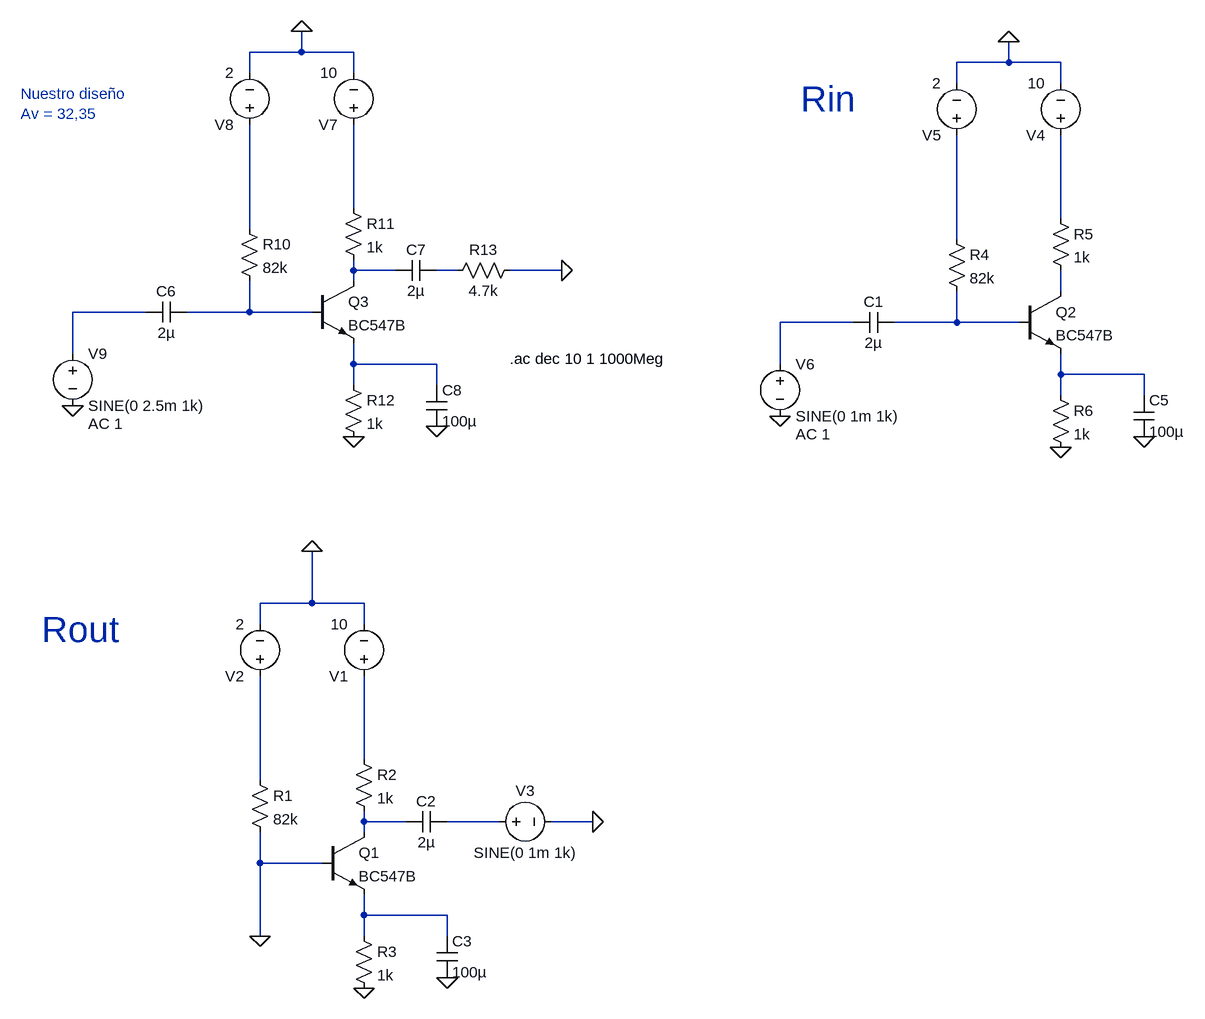
[diagram p0: schematic amplificador_super_magico.asc]
amplificador_super_magico.asc, the LTspice schematic file:
Version 4
SHEET 1 1524 1892
WIRE 16 432 16 400
WIRE 16 432 -64 432
WIRE 96 432 16 432
WIRE 1104 448 1104 416
WIRE 1104 448 1024 448
WIRE 1184 448 1104 448
WIRE -64 464 -64 432
WIRE 96 464 96 432
WIRE 1024 480 1024 448
WIRE 1184 480 1184 448
WIRE 96 672 96 544
WIRE 1184 688 1184 560
WIRE -64 704 -64 544
WIRE 1024 720 1024 560
WIRE 96 768 96 752
WIRE 160 768 96 768
WIRE 256 768 224 768
WIRE 416 768 336 768
WIRE 96 784 96 768
WIRE 1184 800 1184 768
WIRE -224 832 -336 832
WIRE -64 832 -64 784
WIRE -64 832 -160 832
WIRE 32 832 -64 832
WIRE 864 848 752 848
WIRE 1024 848 1024 800
WIRE 1024 848 928 848
WIRE 1120 848 1024 848
WIRE -336 896 -336 832
WIRE 96 912 96 880
WIRE 224 912 96 912
WIRE 752 912 752 848
WIRE 1184 928 1184 896
WIRE 1312 928 1184 928
WIRE 96 944 96 912
WIRE 224 944 224 912
WIRE 1184 960 1184 928
WIRE 1312 960 1312 928
WIRE 32 1280 32 1200
WIRE 32 1280 -48 1280
WIRE 112 1280 32 1280
WIRE -48 1312 -48 1280
WIRE 112 1312 112 1280
WIRE 112 1520 112 1392
WIRE -48 1552 -48 1392
WIRE 112 1616 112 1600
WIRE 176 1616 112 1616
WIRE 320 1616 240 1616
WIRE 464 1616 400 1616
WIRE 112 1632 112 1616
WIRE -48 1680 -48 1632
WIRE 48 1680 -48 1680
WIRE 112 1760 112 1728
WIRE 240 1760 112 1760
WIRE -48 1792 -48 1680
WIRE 112 1792 112 1760
WIRE 240 1792 240 1760
FLAG 96 1024 0
FLAG 16 400 0
FLAG -336 976 0
FLAG 416 768 0
FLAG 224 1008 0
FLAG 112 1872 0
FLAG 240 1856 0
FLAG 32 1200 0
FLAG -48 1792 0
FLAG 464 1616 0
FLAG 1184 1040 0
FLAG 1104 416 0
FLAG 752 992 0
FLAG 1312 1024 0
SYMBOL npn 32 784 R0
SYMATTR InstName Q3
SYMATTR Value BC547B
SYMBOL res -80 688 R0
SYMATTR InstName R10
SYMATTR Value 82k
SYMBOL res 80 656 R0
SYMATTR InstName R11
SYMATTR Value 1k
SYMBOL res 80 928 R0
SYMATTR InstName R12
SYMATTR Value 1k
SYMBOL voltage 96 560 R180
WINDOW 123 0 0 Left 0
WINDOW 39 0 0 Left 0
SYMATTR InstName V7
SYMATTR Value 10
SYMBOL voltage -64 560 R180
WINDOW 123 0 0 Left 0
WINDOW 39 0 0 Left 0
SYMATTR InstName V8
SYMATTR Value 2
SYMBOL voltage -336 880 R0
WINDOW 123 24 124 Left 2
WINDOW 39 0 0 Left 0
SYMATTR Value2 AC 1
SYMATTR InstName V9
SYMATTR Value SINE(0 2.5m 1k)
SYMBOL cap -160 816 R90
WINDOW 0 0 32 VBottom 2
WINDOW 3 32 32 VTop 2
SYMATTR InstName C6
SYMATTR Value 2µ
SYMBOL res 352 752 R90
WINDOW 0 0 56 VBottom 2
WINDOW 3 32 56 VTop 2
SYMATTR InstName R13
SYMATTR Value 4.7k
SYMBOL cap 224 752 R90
WINDOW 0 0 32 VBottom 2
WINDOW 3 32 32 VTop 2
SYMATTR InstName C7
SYMATTR Value 2µ
SYMBOL cap 208 944 R0
SYMATTR InstName C8
SYMATTR Value 100µ
SYMBOL npn 48 1632 R0
SYMATTR InstName Q1
SYMATTR Value BC547B
SYMBOL res -64 1536 R0
SYMATTR InstName R1
SYMATTR Value 82k
SYMBOL res 96 1504 R0
SYMATTR InstName R2
SYMATTR Value 1k
SYMBOL res 96 1776 R0
SYMATTR InstName R3
SYMATTR Value 1k
SYMBOL voltage 112 1408 R180
WINDOW 123 0 0 Left 0
WINDOW 39 0 0 Left 0
SYMATTR InstName V1
SYMATTR Value 10
SYMBOL voltage -48 1408 R180
WINDOW 123 0 0 Left 0
WINDOW 39 0 0 Left 0
SYMATTR InstName V2
SYMATTR Value 2
SYMBOL cap 240 1600 R90
WINDOW 0 0 32 VBottom 2
WINDOW 3 32 32 VTop 2
SYMATTR InstName C2
SYMATTR Value 2µ
SYMBOL cap 224 1792 R0
SYMATTR InstName C3
SYMATTR Value 100µ
SYMBOL voltage 304 1616 R270
WINDOW 0 32 56 VTop 2
WINDOW 3 -32 56 VBottom 2
WINDOW 123 0 0 Left 0
WINDOW 39 0 0 Left 0
SYMATTR InstName V3
SYMATTR Value SINE(0 1m 1k)
SYMBOL npn 1120 800 R0
SYMATTR InstName Q2
SYMATTR Value BC547B
SYMBOL res 1008 704 R0
SYMATTR InstName R4
SYMATTR Value 82k
SYMBOL res 1168 672 R0
SYMATTR InstName R5
SYMATTR Value 1k
SYMBOL res 1168 944 R0
SYMATTR InstName R6
SYMATTR Value 1k
SYMBOL voltage 1184 576 R180
WINDOW 123 0 0 Left 0
WINDOW 39 0 0 Left 0
SYMATTR InstName V4
SYMATTR Value 10
SYMBOL voltage 1024 576 R180
WINDOW 123 0 0 Left 0
WINDOW 39 0 0 Left 0
SYMATTR InstName V5
SYMATTR Value 2
SYMBOL voltage 752 896 R0
WINDOW 123 24 124 Left 2
WINDOW 39 0 0 Left 0
SYMATTR Value2 AC 1
SYMATTR InstName V6
SYMATTR Value SINE(0 1m 1k)
SYMBOL cap 928 832 R90
WINDOW 0 0 32 VBottom 2
WINDOW 3 32 32 VTop 2
SYMATTR InstName C1
SYMATTR Value 2µ
SYMBOL cap 1296 960 R0
SYMATTR InstName C5
SYMATTR Value 100µ
TEXT 336 904 Left 2 !.ac dec 10 1 1000Meg
TEXT -416 496 Left 2 ;Nuestro diseño\nAv = 32,35
TEXT 784 504 Left 5 ;Rin
TEXT -384 1320 Left 5 ;Rout

The netlist it stands for:
* amplificador_super_magico.asc
Q3 N005 N009 N012 0 BC547B
R10 N003 N009 82k
R11 N001 N005 1k
R12 N012 0 1k
V7 N001 0 10
V8 N003 0 2
V9 N008 0 SINE(0 2.5m 1k) AC 1
C6 N009 N008 2µ
R13 0 N006 4.7k
C7 N006 N005 2µ
C8 N012 0 100µ
Q1 N016 0 N018 0 BC547B
R1 N015 0 82k
R2 N014 N016 1k
R3 N018 0 1k
V1 N014 0 10
V2 N015 0 2
C2 N017 N016 2µ
C3 N018 0 100µ
V3 N017 0 SINE(0 1m 1k)
Q2 N007 N011 N013 0 BC547B
R4 N004 N011 82k
R5 N002 N007 1k
R6 N013 0 1k
V4 N002 0 10
V5 N004 0 2
V6 N010 0 SINE(0 1m 1k) AC 1
C1 N011 N010 2µ
C5 N013 0 100µ
.model NPN NPN
.model PNP PNP
.lib standard.bjt
.ac dec 10 1 1000Meg
* Nuestro diseño
* Av = 32,35
* Rin
* Rout
.backanno
.end